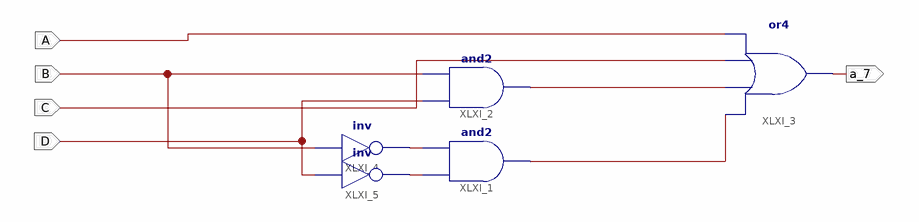
[diagram p0: schematic sheet 1]
// Xilinx ISE schematic bcd_for_a.sch (spartan6) as structural Verilog: 5 symbols, 5 ports
module bcd_for_a (
  input  B,
  input  C,
  input  D,
  input  A,
  output a_7
);

  wire XLXN_1, XLXN_2, XLXN_12, XLXN_14;

  and XLXI_1 (XLXN_14, XLXN_2, XLXN_1);
  and XLXI_2 (XLXN_12, D, B);
  or XLXI_3 (a_7, XLXN_14, XLXN_12, C, A);
  not XLXI_4 (XLXN_1, B);
  not XLXI_5 (XLXN_2, D);
endmodule
